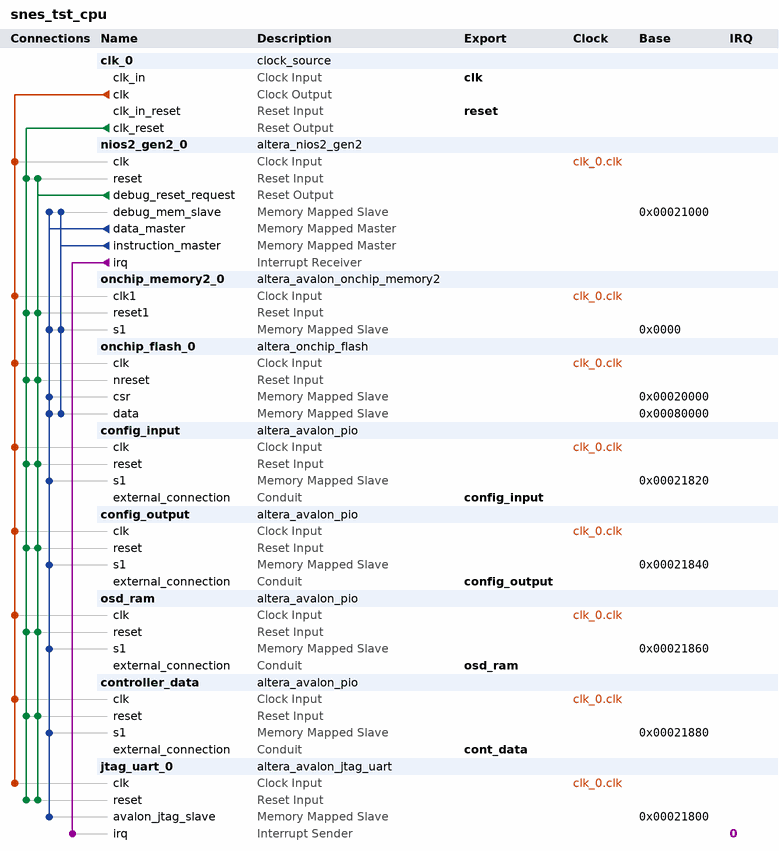
[diagram p0: system contents]
# Platform Designer (Qsys) system snes_tst_cpu, MAX 10 10M04SAE144C8G
# Parameters at their usual value, and those the tool derives, are not listed.
package require -exact qsys 20.1
create_system snes_tst_cpu
set_project_property DEVICE_FAMILY {MAX 10}
set_project_property DEVICE 10M04SAE144C8G

add_instance clk_0 clock_source 20.1
set_instance_parameter_value clk_0 clockFrequency 21477000

add_instance nios2_gen2_0 altera_nios2_gen2 20.1
set_instance_parameter_value nios2_gen2_0 dcache_size 2048
set_instance_parameter_value nios2_gen2_0 exceptionSlave onchip_memory2_0.s1
set_instance_parameter_value nios2_gen2_0 icache_size 4096
set_instance_parameter_value nios2_gen2_0 impl Tiny
set_instance_parameter_value nios2_gen2_0 resetSlave onchip_memory2_0.s1

add_instance onchip_memory2_0 altera_avalon_onchip_memory2 20.1
set_instance_parameter_value onchip_memory2_0 dataWidth 32
set_instance_parameter_value onchip_memory2_0 dualPort false
set_instance_parameter_value onchip_memory2_0 initMemContent true
set_instance_parameter_value onchip_memory2_0 initializationFileName D:/Adatok/ElektroProjektek/FPGA/SNES_TST/software/snes_tst/mem_init/snes_tst_cpu_onchip_memory2_0.hex
set_instance_parameter_value onchip_memory2_0 memorySize 8192

add_instance onchip_flash_0 altera_onchip_flash 20.1
set_instance_parameter_value onchip_flash_0 CONFIGURATION_MODE {Single Uncompressed Image with Memory Initialization}
set_instance_parameter_value onchip_flash_0 SECTOR_ACCESS_MODE {Read and write,Read and write,Read and write,Read and write,Read and write}
set_instance_parameter_value onchip_flash_0 initFlashContent false
set_instance_parameter_value onchip_flash_0 initializationFileName altera_onchip_flash.hex
set_instance_parameter_value onchip_flash_0 useNonDefaultInitFile false

add_instance config_input altera_avalon_pio 20.1
set_instance_parameter_value config_input direction Input
set_instance_parameter_value config_input width 32

add_instance config_output altera_avalon_pio 20.1
set_instance_parameter_value config_output bitModifyingOutReg true
set_instance_parameter_value config_output direction Output
set_instance_parameter_value config_output width 32

add_instance osd_ram altera_avalon_pio 20.1
set_instance_parameter_value osd_ram bitModifyingOutReg true
set_instance_parameter_value osd_ram direction Output
set_instance_parameter_value osd_ram width 23

add_instance controller_data altera_avalon_pio 20.1
set_instance_parameter_value controller_data direction Input
set_instance_parameter_value controller_data width 16

add_instance jtag_uart_0 altera_avalon_jtag_uart 20.1
set_instance_parameter_value jtag_uart_0 simInteractiveOptions NO_INTERACTIVE_WINDOWS

# connections
add_connection clk_0.clk config_input.clk clock
add_connection clk_0.clk config_output.clk clock
add_connection clk_0.clk controller_data.clk clock
add_connection clk_0.clk jtag_uart_0.clk clock
add_connection clk_0.clk nios2_gen2_0.clk clock
add_connection clk_0.clk onchip_flash_0.clk clock
add_connection clk_0.clk onchip_memory2_0.clk1 clock
add_connection clk_0.clk osd_ram.clk clock
add_connection clk_0.clk_reset config_input.reset reset
add_connection clk_0.clk_reset config_output.reset reset
add_connection clk_0.clk_reset controller_data.reset reset
add_connection clk_0.clk_reset jtag_uart_0.reset reset
add_connection clk_0.clk_reset nios2_gen2_0.reset reset
add_connection clk_0.clk_reset onchip_flash_0.nreset reset
add_connection clk_0.clk_reset onchip_memory2_0.reset1 reset
add_connection clk_0.clk_reset osd_ram.reset reset
add_connection nios2_gen2_0.debug_reset_request config_input.reset reset
add_connection nios2_gen2_0.debug_reset_request config_output.reset reset
add_connection nios2_gen2_0.debug_reset_request controller_data.reset reset
add_connection nios2_gen2_0.debug_reset_request jtag_uart_0.reset reset
add_connection nios2_gen2_0.debug_reset_request nios2_gen2_0.reset reset
add_connection nios2_gen2_0.debug_reset_request onchip_flash_0.nreset reset
add_connection nios2_gen2_0.debug_reset_request onchip_memory2_0.reset1 reset
add_connection nios2_gen2_0.debug_reset_request osd_ram.reset reset
add_connection nios2_gen2_0.data_master config_input.s1 avalon
set_connection_parameter_value nios2_gen2_0.data_master/config_input.s1 baseAddress 0x00021820
add_connection nios2_gen2_0.data_master config_output.s1 avalon
set_connection_parameter_value nios2_gen2_0.data_master/config_output.s1 baseAddress 0x00021840
add_connection nios2_gen2_0.data_master controller_data.s1 avalon
set_connection_parameter_value nios2_gen2_0.data_master/controller_data.s1 baseAddress 0x00021880
add_connection nios2_gen2_0.data_master jtag_uart_0.avalon_jtag_slave avalon
set_connection_parameter_value nios2_gen2_0.data_master/jtag_uart_0.avalon_jtag_slave baseAddress 0x00021800
add_connection nios2_gen2_0.data_master nios2_gen2_0.debug_mem_slave avalon
set_connection_parameter_value nios2_gen2_0.data_master/nios2_gen2_0.debug_mem_slave baseAddress 0x00021000
add_connection nios2_gen2_0.data_master onchip_flash_0.csr avalon
set_connection_parameter_value nios2_gen2_0.data_master/onchip_flash_0.csr baseAddress 0x00020000
add_connection nios2_gen2_0.data_master onchip_flash_0.data avalon
set_connection_parameter_value nios2_gen2_0.data_master/onchip_flash_0.data baseAddress 0x00080000
add_connection nios2_gen2_0.data_master onchip_memory2_0.s1 avalon
set_connection_parameter_value nios2_gen2_0.data_master/onchip_memory2_0.s1 baseAddress 0x0000
add_connection nios2_gen2_0.data_master osd_ram.s1 avalon
set_connection_parameter_value nios2_gen2_0.data_master/osd_ram.s1 baseAddress 0x00021860
add_connection nios2_gen2_0.instruction_master nios2_gen2_0.debug_mem_slave avalon
set_connection_parameter_value nios2_gen2_0.instruction_master/nios2_gen2_0.debug_mem_slave baseAddress 0x00021000
add_connection nios2_gen2_0.instruction_master onchip_flash_0.data avalon
set_connection_parameter_value nios2_gen2_0.instruction_master/onchip_flash_0.data baseAddress 0x00080000
add_connection nios2_gen2_0.instruction_master onchip_memory2_0.s1 avalon
set_connection_parameter_value nios2_gen2_0.instruction_master/onchip_memory2_0.s1 baseAddress 0x0000
add_connection nios2_gen2_0.irq jtag_uart_0.irq interrupt
set_connection_parameter_value nios2_gen2_0.irq/jtag_uart_0.irq irqNumber 0

# exported interfaces
add_interface clk clock sink
set_interface_property clk EXPORT_OF clk_0.clk_in
add_interface config_input conduit end
set_interface_property config_input EXPORT_OF config_input.external_connection
add_interface config_output conduit end
set_interface_property config_output EXPORT_OF config_output.external_connection
add_interface cont_data conduit end
set_interface_property cont_data EXPORT_OF controller_data.external_connection
add_interface osd_ram conduit end
set_interface_property osd_ram EXPORT_OF osd_ram.external_connection
add_interface reset reset sink
set_interface_property reset EXPORT_OF clk_0.clk_in_reset

set_interconnect_requirement {$system} qsys_mm.clockCrossingAdapter HANDSHAKE
set_interconnect_requirement {$system} qsys_mm.enableEccProtection FALSE
set_interconnect_requirement {$system} qsys_mm.insertDefaultSlave FALSE
set_interconnect_requirement {$system} qsys_mm.maxAdditionalLatency 1

save_system snes_tst_cpu.qsys
